# EAGLE schematic Knob connections (EAGLE 9.2.2)
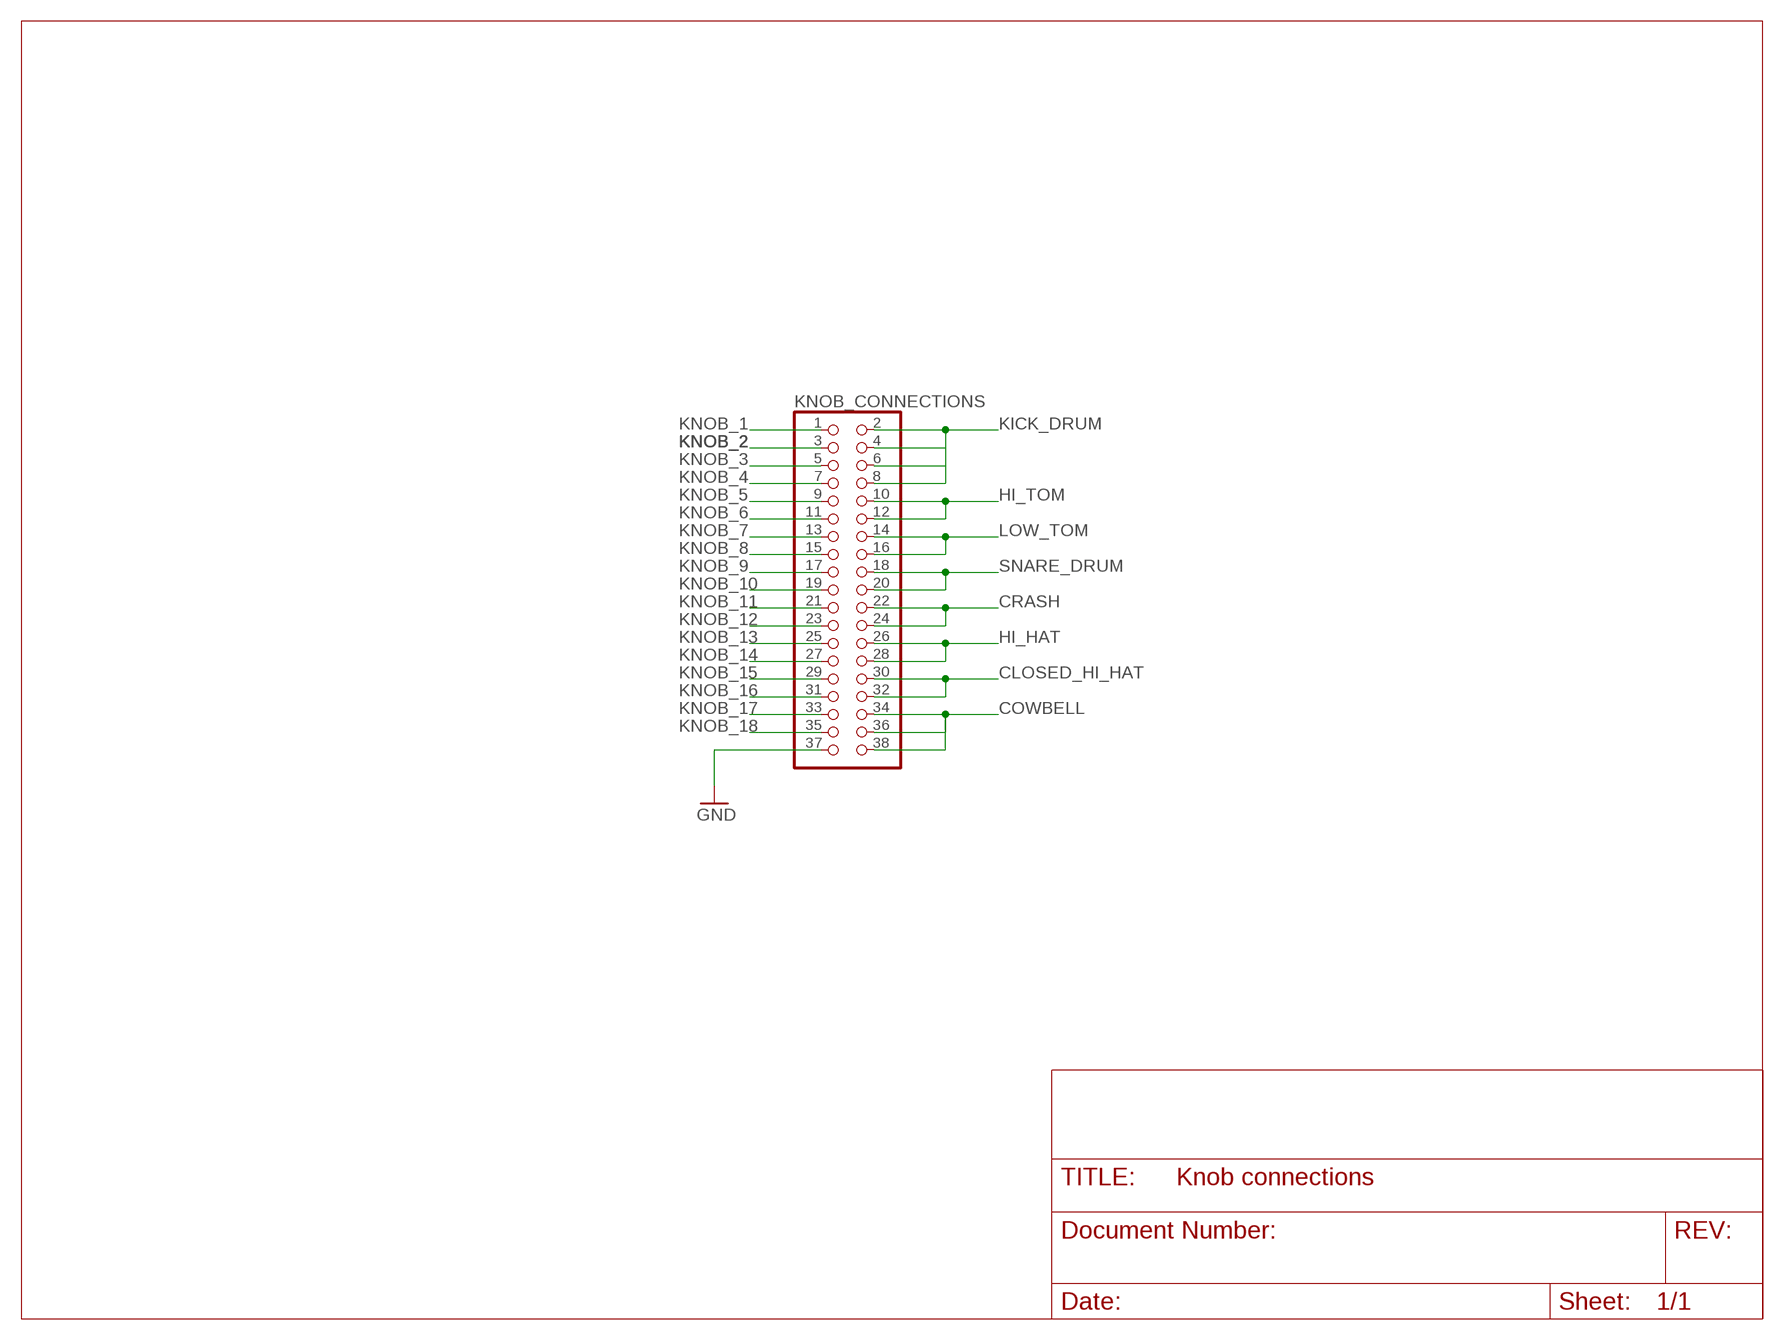
[diagram p0: schematic, sheet 1]

## Parts
KNOB_CONNECTIONS  PINHD-2X19  [2X19]

## Nets
CLOSED_HI_HAT: KNOB_CONNECTIONS.30 KNOB_CONNECTIONS.32
COWBELL: KNOB_CONNECTIONS.34 KNOB_CONNECTIONS.36 KNOB_CONNECTIONS.38
CRASH: KNOB_CONNECTIONS.22 KNOB_CONNECTIONS.24
GND: KNOB_CONNECTIONS.37
HI_HAT: KNOB_CONNECTIONS.26 KNOB_CONNECTIONS.28
HI_TOM: KNOB_CONNECTIONS.10 KNOB_CONNECTIONS.12
KICK_DRUM: KNOB_CONNECTIONS.2 KNOB_CONNECTIONS.8
KNOB_1: KNOB_CONNECTIONS.1
KNOB_2: KNOB_CONNECTIONS.3
KNOB_3: KNOB_CONNECTIONS.5
KNOB_4: KNOB_CONNECTIONS.7
KNOB_5: KNOB_CONNECTIONS.9
KNOB_6: KNOB_CONNECTIONS.11
KNOB_7: KNOB_CONNECTIONS.13
KNOB_8: KNOB_CONNECTIONS.15
KNOB_9: KNOB_CONNECTIONS.17
KNOB_10: KNOB_CONNECTIONS.19
KNOB_11: KNOB_CONNECTIONS.21
KNOB_12: KNOB_CONNECTIONS.23
KNOB_13: KNOB_CONNECTIONS.25
KNOB_14: KNOB_CONNECTIONS.27
KNOB_15: KNOB_CONNECTIONS.29
KNOB_16: KNOB_CONNECTIONS.31
KNOB_17: KNOB_CONNECTIONS.33
KNOB_18: KNOB_CONNECTIONS.35
LOW_TOM: KNOB_CONNECTIONS.14 KNOB_CONNECTIONS.16
N$2: KNOB_CONNECTIONS.4
N$3: KNOB_CONNECTIONS.6
SNARE_DRUM: KNOB_CONNECTIONS.18 KNOB_CONNECTIONS.20

## Library data of the parts
KNOB_CONNECTIONS = pinhead:PINHD-2X19: PIN HEADER